# EAGLE design TapController_12V_v1.1 (EAGLE 9.4.0)

## Sheet 1 of 3
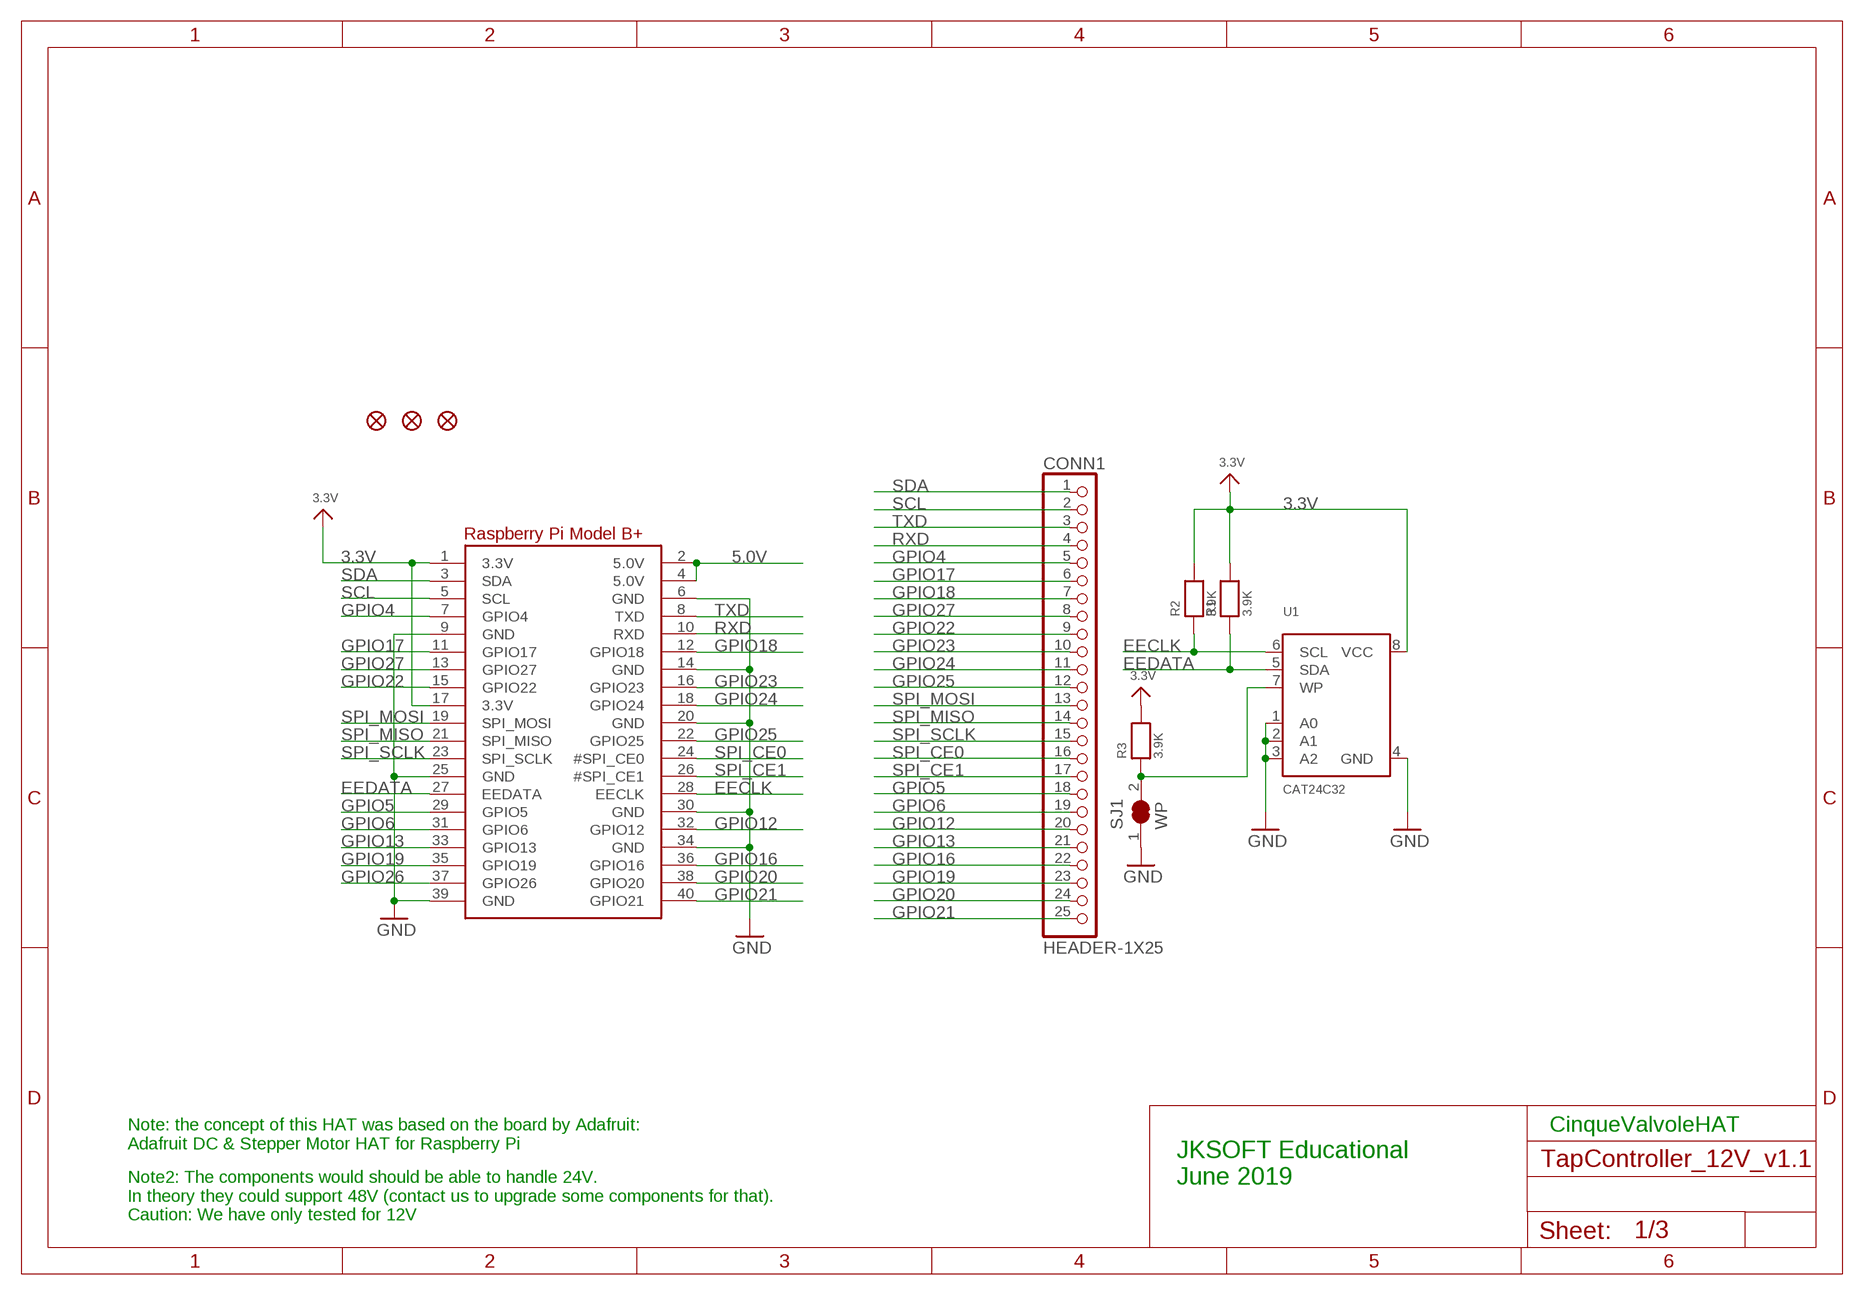
[diagram p0: schematic, sheet 1]

### Parts
CONN1  HEADER-1X25  [1X25_ROUND_70MIL]
FID1  FIDUCIAL""  [FIDUCIAL_1MM]
FID2  FIDUCIAL""  [FIDUCIAL_1MM]
FID3  FIDUCIAL""  [FIDUCIAL_1MM]
R1  3.9K  RESISTOR0805_NOOUTLINE  [0805-NO@1]
R2  3.9K  RESISTOR0805_NOOUTLINE  [0805-NO@1]
R3  3.9K  RESISTOR0805_NOOUTLINE  [0805-NO@1]
RPI1  RASPBERRYPI_BPLUS_HATSLOTS  [PI_HAT_SLOTS]
SJ1  WP  SOLDERJUMPER_CLOSED  [SOLDERJUMPER_CLOSEDWIRE]
U1  CAT24C32  EEPROM_I2C_SOIC8_GENERIC  [SOIC8_150MIL]

### Nets
3.3V: R1.2 R2.2 R3.2 RPI1.1(3.3V) RPI1.17(3.3V) U1.8(VCC) ; also sheet 2
5.0V: RPI1.2(5.0V) RPI1.4(5.0V)
EECLK: R2.1 RPI1.28(EECLK) U1.6(SCL)
EEDATA: R1.1 RPI1.27(EEDATA) U1.5(SDA)
GND: RPI1.6(GND) RPI1.9(GND) RPI1.14(GND) RPI1.20(GND) RPI1.25(GND) RPI1.30(GND) RPI1.34(GND) RPI1.39(GND) SJ1.1 U1.1(A0) U1.2(A1) U1.3(A2) U1.4(GND) ; also sheet 2,3
GPIO4: CONN1.5 RPI1.7(GPIO4)
GPIO5: CONN1.18 RPI1.29(GPIO5)
GPIO6: CONN1.19 RPI1.31(GPIO6)
GPIO12: CONN1.20 RPI1.32(GPIO12)
GPIO13: CONN1.21 RPI1.33(GPIO13)
GPIO16: CONN1.22 RPI1.36(GPIO16)
GPIO17: CONN1.6 RPI1.11(GPIO17)
GPIO18: CONN1.7 RPI1.12(GPIO18)
GPIO19: CONN1.23 RPI1.35(GPIO19)
GPIO20: CONN1.24 RPI1.38(GPIO20)
GPIO21: CONN1.25 RPI1.40(GPIO21)
GPIO22: CONN1.9 RPI1.15(GPIO22)
GPIO23: CONN1.10 RPI1.16(GPIO23)
GPIO24: CONN1.11 RPI1.18(GPIO24)
GPIO25: CONN1.12 RPI1.22(GPIO25)
GPIO26: RPI1.37(GPIO26)
GPIO27: CONN1.8 RPI1.13(GPIO27)
N$16: R3.1 SJ1.2 U1.7(WP)
RXD: CONN1.4 RPI1.10(RXD)
SCL: CONN1.2 RPI1.5(SCL) ; also sheet 2
SDA: CONN1.1 RPI1.3(SDA) ; also sheet 2
SPI_CE0: CONN1.16 RPI1.24(#SPI_CE0)
SPI_CE1: CONN1.17 RPI1.26(#SPI_CE1)
SPI_MISO: CONN1.14 RPI1.21(SPI_MISO)
SPI_MOSI: CONN1.13 RPI1.19(SPI_MOSI)
SPI_SCLK: CONN1.15 RPI1.23(SPI_SCLK)
TXD: CONN1.3 RPI1.8(TXD)

### Notes on the sheet
- CinqueValvoleHAT
- Note: the concept of this HAT was based on the board by Adafruit:
  Adafruit DC & Stepper Motor HAT for Raspberry Pi
- JKSOFT Educational
  June 2019
- Note2: The components would should be able to handle 24V. 
  In theory they could support 48V (contact us to upgrade some components for that).
  Caution: We have only tested for 12V

## Sheet 2 of 3
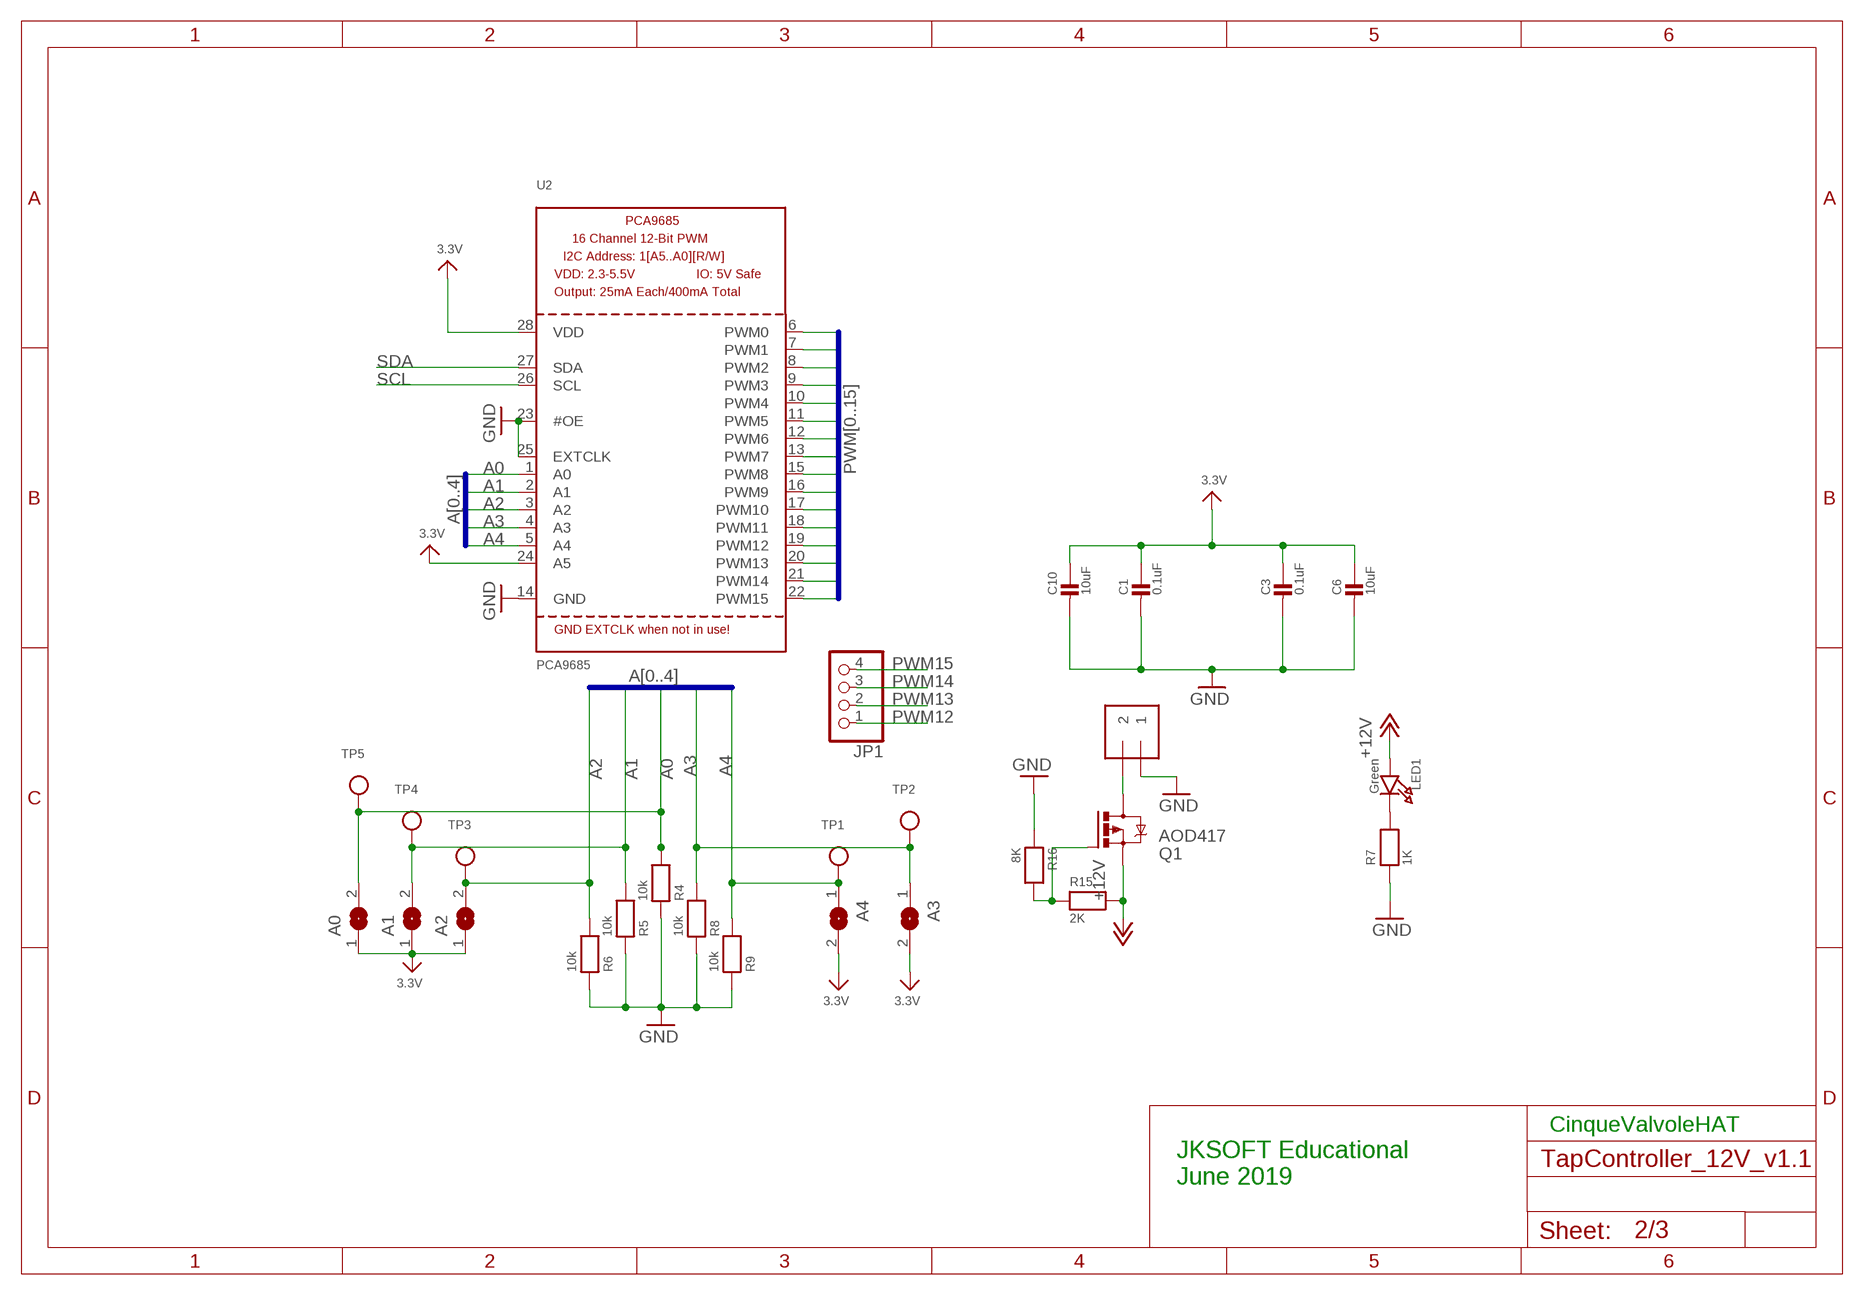
[diagram p1: schematic, sheet 2]

### Parts
A0  SOLDERJUMPERREFLOW_NOPASTE  [SOLDERJUMPER_REFLOW_NOPASTE]
A1  SOLDERJUMPERREFLOW_NOPASTE  [SOLDERJUMPER_REFLOW_NOPASTE]
A2  SOLDERJUMPERREFLOW_NOPASTE  [SOLDERJUMPER_REFLOW_NOPASTE]
A3  SOLDERJUMPERREFLOW_NOPASTE  [SOLDERJUMPER_REFLOW_NOPASTE]
A4  SOLDERJUMPERREFLOW_NOPASTE  [SOLDERJUMPER_REFLOW_NOPASTE]
C1  0.1uF  CAP_CERAMIC0805-NOOUTLINE  [0805-NO]
C3  0.1uF  CAP_CERAMIC0805-NOOUTLINE  [0805-NO]
C6  10uF  CAP_CERAMIC0805-NOOUTLINE  [0805-NO]
C10  10uF  CAP_CERAMIC0805-NOOUTLINE  [0805-NO]
JP1  HEADER-1X476MIL  [1X04_ROUND_76]
LED1  Green  LED0805_NOOUTLINE  [CHIPLED_0805_NOOUTLINE]
MPOWER  1X2-3.5MM  [1X2-3.5MM]
Q1  AOD417  IRFR5305  [D-PAK_TO252AA]
R4  10k  RESISTOR0805_NOOUTLINE  [0805-NO@1]
R5  10k  RESISTOR0805_NOOUTLINE  [0805-NO@1]
R6  10k  RESISTOR0805_NOOUTLINE  [0805-NO@1]
R7  1K  RESISTOR0805_NOOUTLINE  [0805-NO@1]
R8  10k  RESISTOR0805_NOOUTLINE  [0805-NO@1]
R9  10k  RESISTOR0805_NOOUTLINE  [0805-NO@1]
R15  2K  RESISTOR0805_NOOUTLINE  [0805-NO@1]
R16  8K  RESISTOR0805_NOOUTLINE  [0805-NO@1]
TP1  TESTPOINTROUND2MM  [TESTPOINT_ROUND_2MM]
TP2  TESTPOINTROUND2MM  [TESTPOINT_ROUND_2MM]
TP3  TESTPOINTROUND2MM  [TESTPOINT_ROUND_2MM]
TP4  TESTPOINTROUND2MM  [TESTPOINT_ROUND_2MM]
TP5  TESTPOINTROUND2MM  [TESTPOINT_ROUND_2MM]
U2  PCA9685  [TSSOP28]

### Nets
3.3V: A0.1 A1.1 A2.1 A3.2 A4.2 C1.1 C3.1 C6.1 C10.1 U2.24(A5) U2.28(VDD) ; also sheet 1
12V: MPOWER.2 Q1.4(D)
+12V: LED1.A Q1.3(S) R15.2 ; also sheet 3
A0: A0.2 R4.2 TP5.P$1 U2.1(A0)
A1: A1.2 R5.2 TP4.P$1 U2.2(A1)
A2: A2.2 R6.2 TP3.P$1 U2.3(A2)
A3: A3.1 R8.2 TP2.P$1 U2.4(A3)
A4: A4.1 R9.2 TP1.P$1 U2.5(A4)
GND: C1.2 C3.2 C6.2 C10.2 MPOWER.1 R4.1 R5.1 R6.1 R7.1 R8.1 R9.1 R16.1 U2.14(GND) U2.23(#OE) U2.25(EXTCLK) ; also sheet 1,3
N$3: Q1.1(G) R15.1 R16.2
N$133: LED1.C R7.2
PWM0: U2.6(PWM0) ; also sheet 3
PWM1: U2.7(PWM1) ; also sheet 3
PWM2: U2.8(PWM2) ; also sheet 3
PWM3: U2.9(PWM3) ; also sheet 3
PWM4: U2.10(PWM4) ; also sheet 3
PWM5: U2.11(PWM5) ; also sheet 3
PWM6: U2.12(PWM6) ; also sheet 3
PWM7: U2.13(PWM7) ; also sheet 3
PWM8: U2.15(PWM8) ; also sheet 3
PWM9: U2.16(PWM9) ; also sheet 3
PWM10: U2.17(PWM10)
PWM11: U2.18(PWM11)
PWM12: JP1.1 U2.19(PWM12)
PWM13: JP1.2 U2.20(PWM13)
PWM14: JP1.3 U2.21(PWM14)
PWM15: JP1.4 U2.22(PWM15)
SCL: U2.26(SCL) ; also sheet 1
SDA: U2.27(SDA) ; also sheet 1

### Buses
PWM[0..15]
A[0..4]

### Notes on the sheet
- CinqueValvoleHAT
- JKSOFT Educational
  June 2019

## Sheet 3 of 3
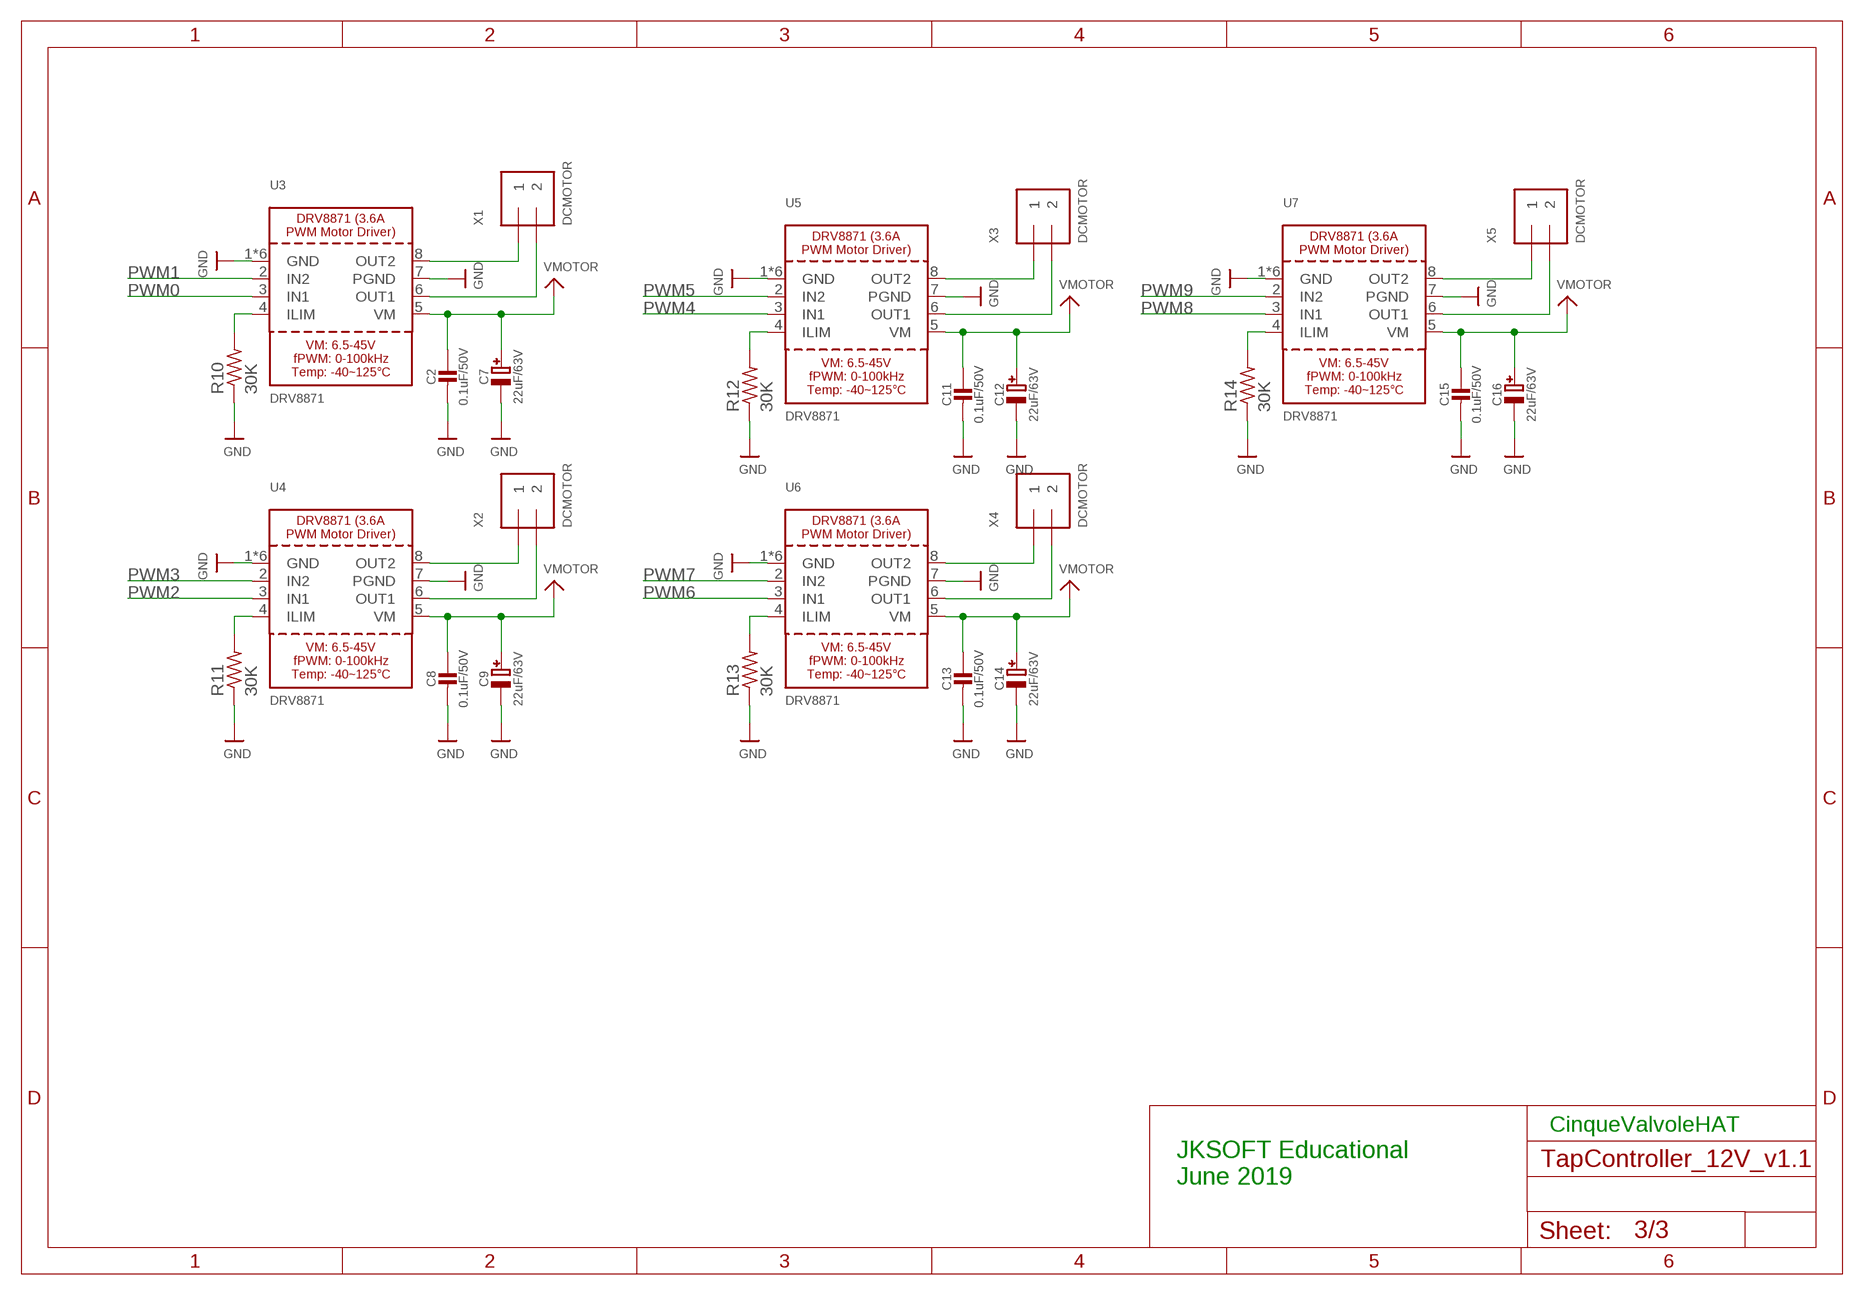
[diagram p2: schematic, sheet 3]

### Parts
C2  0.1uF/50V  CAP_CERAMIC0805-NOOUTLINE  [0805-NO]
C7  22uF/63V  CAP_ELECTROLYTICPANASONIC_D  [PANASONIC_D]
C8  0.1uF/50V  CAP_CERAMIC0805-NOOUTLINE  [0805-NO]
C9  22uF/63V  CAP_ELECTROLYTICPANASONIC_D  [PANASONIC_D]
C11  0.1uF/50V  CAP_CERAMIC0805-NOOUTLINE  [0805-NO]
C12  22uF/63V  CAP_ELECTROLYTICPANASONIC_D  [PANASONIC_D]
C13  0.1uF/50V  CAP_CERAMIC0805-NOOUTLINE  [0805-NO]
C14  22uF/63V  CAP_ELECTROLYTICPANASONIC_D  [PANASONIC_D]
C15  0.1uF/50V  CAP_CERAMIC0805-NOOUTLINE  [0805-NO]
C16  22uF/63V  CAP_ELECTROLYTICPANASONIC_D  [PANASONIC_D]
R10  30K  R-US_R0805W  [R0805W]
R11  30K  R-US_R0805W  [R0805W]
R12  30K  R-US_R0805W  [R0805W]
R13  30K  R-US_R0805W  [R0805W]
R14  30K  R-US_R0805W  [R0805W]
U3  DRV8871  [HSOP8]
U4  DRV8871  [HSOP8]
U5  DRV8871  [HSOP8]
U6  DRV8871  [HSOP8]
U7  DRV8871  [HSOP8]
X1  DCMOTOR  TERMBLOCK_1X2  [TERMBLOCK_1X2-3.5MM]
X2  DCMOTOR  TERMBLOCK_1X2  [TERMBLOCK_1X2-3.5MM]
X3  DCMOTOR  TERMBLOCK_1X2  [TERMBLOCK_1X2-3.5MM]
X4  DCMOTOR  TERMBLOCK_1X2  [TERMBLOCK_1X2-3.5MM]
X5  DCMOTOR  TERMBLOCK_1X2  [TERMBLOCK_1X2-3.5MM]

### Nets
+12V: C2.1 C7.+ C8.1 C9.+ C11.1 C12.+ C13.1 C14.+ C15.1 C16.+ U3.5(VM) U4.5(VM) U5.5(VM) U6.5(VM) U7.5(VM) ; supply symbol labelled VMOTOR ; also sheet 2
GND: C2.2 C7.- C8.2 C9.- C11.2 C12.- C13.2 C14.- C15.2 C16.- R10.1 R11.1 R12.1 R13.1 R14.1 U3.1(GND) U3.7(PGND) U3.GND U3.P$1(GND) U3.P$2(GND) U3.P$3(GND) U3.P$4(GND) U4.1(GND) U4.7(PGND) U4.GND U4.P$1(GND) U4.P$2(GND) U4.P$3(GND) U4.P$4(GND) U5.1(GND) U5.7(PGND) U5.GND U5.P$1(GND) U5.P$2(GND) U5.P$3(GND) U5.P$4(GND) U6.1(GND) U6.7(PGND) U6.GND U6.P$1(GND) U6.P$2(GND) U6.P$3(GND) U6.P$4(GND) U7.1(GND) U7.7(PGND) U7.GND U7.P$1(GND) U7.P$2(GND) U7.P$3(GND) U7.P$4(GND) ; also sheet 1,2
N$1: R10.2 U3.4(ILIM)
N$88: R11.2 U4.4(ILIM)
N$89: R12.2 U5.4(ILIM)
N$90: R13.2 U6.4(ILIM)
N$91: R14.2 U7.4(ILIM)
OUT1: U3.6(OUT1) X1.2
OUT2: U3.8(OUT2) X1.1
OUT3: U4.8(OUT2) X2.1
OUT4: U4.6(OUT1) X2.2
OUT5: U5.8(OUT2) X3.1
OUT6: U5.6(OUT1) X3.2
OUT7: U6.8(OUT2) X4.1
OUT8: U6.6(OUT1) X4.2
OUT9: U7.8(OUT2) X5.1
OUT10: U7.6(OUT1) X5.2
PWM0: U3.3(IN1) ; also sheet 2
PWM1: U3.2(IN2) ; also sheet 2
PWM2: U4.3(IN1) ; also sheet 2
PWM3: U4.2(IN2) ; also sheet 2
PWM4: U5.3(IN1) ; also sheet 2
PWM5: U5.2(IN2) ; also sheet 2
PWM6: U6.3(IN1) ; also sheet 2
PWM7: U6.2(IN2) ; also sheet 2
PWM8: U7.3(IN1) ; also sheet 2
PWM9: U7.2(IN2) ; also sheet 2

### Notes on the sheet
- CinqueValvoleHAT
- JKSOFT Educational
  June 2019

## Library data of the parts
A0 A1-A4 = microbuilder:SOLDERJUMPER: SMD Solder JUMPER Solder the two pads together to create a connection, or remove the solder to break it. REFLOW - Use this footprint for solder paste and reflow ovens. WAVE - Use this footprint for hand-soldering (larger pads). CLOSED - Has a trace between the two pads to ensure it is closed by default. The trace needs to be cut to disable the jumper, and can be closed again by creating a solder bridge between the two pads.
C1-C3 C6 C8 C10 C11 C13 C15 = microbuilder:CAP_CERAMIC: Ceramic Capacitors For new designs, use the packages preceded by an '_' character since they are more reliable: The following footprints should be used on most boards: _0402 - Standard footprint for regular board layouts _0603 - Standard footprint for regular board layouts _0805 - Standard footprint for regular board layouts _1206 - Standard footprint for regular board layouts For extremely tight-pitch boards where space is at a premium, the following 'micro-pitch' footprints can be used (smaller pads, no silkscreen outline, etc.): _0402MP - Micro-pitch footprint for very dense/compact boards _0603MP - Micro-pitch footprint for very dense/compact boards _0805MP - Micro-pitch footprint for very dense/compact boards _1206MP - Micro-pitch footprint for very dense/compact boards
C7 C9 C12 C14 C16 = microbuilder:CAP_ELECTROLYTIC: Electrolytic Capacitors SMT PANASONIC_C - Size C Panasonic Electrolytic Aluminum Capacitor 47µF 16V 20% Electrolytic Capacitor [Digikey: PCE3890TR-ND] PANASONIC_D - Size D Panasonic Electrolytic Aluminum Capacitor 100µF 25V 20% Electrolytic Capacitor [Digikey: PCE3898TR-ND] PTH 3.5 mm grid, 8 mm diameter ... 3.5 mm grid, 10 mm diameter ...
CONN1 = microbuilder:HEADER-1X25
FID1-FID3 = microbuilder:FIDUCIAL: Fiducial Alignment Points Various fiducial points for machine vision alignment.; BOM: EXCLUDE
JP1 = microbuilder:HEADER-1X4: PIN HEADER
LED1 = microbuilder:LED: LED 0603 - 0603 Surface Mount Package 2mA: Green LED - Low Power (3.9mcd, 2ma, 1.7Vf) - Digikey: 475-2709-2-ND Orange LED - Low Power (9.8mcd, 2ma, 1.8Vf) - Digikey: 475-1194-2-ND Red LED - Low Power (5mcd, 2ma, 1.8Vf) - Digikey: 475-1195-2-ND Yellow LED - Low Power (7mcd, 2ma, 1.8Vf) - Digikey: 475-1196-2-ND 5mA: Blue LED - Low Power (17mcd, 5ma, 2.9Vf) - Digikey: LNJ937W8CRACT-ND 0805 - 0805 Surface Mount Package 2mA: Red LED (8.8mcd, 2mA, 1.8Vf, Clear) - Low Power [Digikey: 475-2510-1-ND] Green LED (5mcd, 2mA, 1.8Vf, Clear) - Low Power [Digikey: 475-2730-1-ND] Yellow LED (11.3mcd, 2mA, 1.8Vf, Clear) - Low Power [Digikey: 475-2555-1-ND] 20mA: Red LED (104mcd, 20mA, Diffused) - LS R976 [Digikey: 475-1278-6-ND] Red LED (12mcd, 20mA, 2.0Vf, Clear) - APT2012EC [Digikey: 754-1128-1-ND] Green LED (15mcd, 20mA, 2.2Vf, Clear) - APT2012GC [Digikey: 754-1131-1-ND] Orange LED (160mcd, 20mA, 2.1Vf, Clear) - APT2012SECK [Digikey: 754-1130-1-ND] 1206 - 1206 Surface Mount Package Green LED (26mcd, 20mA, Diffused) - LG N971 [Digikey: 475-1407-6-ND] Red LED (15mcd, 20mA, Diffused) - LH N974 [Digikey: 475-1416-6-ND] Cree - Cree High-Power Surface Mount LEDs XPEBWT-L1-0000-00D50 - White 111lm 350mA 2.9Vf 6200K 110° XTEAWT-00-0000-00000LEE3 - White 114lm 350mA 2.85Vf 5000K 115° Everlight - Everlight 45-21 Series Surface Mount LEDs 45-21/QK2C-B2832AC2CB2/2T - Warm White 2000mcd 20mA 3.25Vf 3050K 120° 45-21/LK2C-B38452C4CB2/2T - Nuetral White 2000mcd 20mA 3.25Vf 4150K 120° 45-21/LK2C-B50634C6CB2/2T - Cold White 2200mcd 20mA 3.25Vf 5650K 120° PLCC2 Reverse Mount LS T77K-J1L2-1-0-2-R18-Z - Red 11.25mcd 2mA 1.8Vf 630nm 120° LO T77K-L1M2-24-Z - Orange 19.6mcd 2mA 1.8Vf 606nm 120° LY T77K-K2M1-26-Z - Yellow 15.7mcd 2mA 1.8Vf 587nm 120°
MPOWER = adafruit:1X2: 3.5mm Terminal block http://www.ladyada.net/library/pcb/eaglelibrary.html
Q1 = transistor-power:IRF?5305: HEXFET Power MOSFET Source: http://www.irf.com/product-info/datasheets/data/irfr5305pbf.pdf
R1-R9 R15 R16 = microbuilder:RESISTOR: Resistors For new designs, use the packages preceded by an '_' character since they are more reliable: The following footprints should be used on most boards: _0402 - Standard footprint for regular board layouts _0603 - Standard footprint for regular board layouts _0805 - Standard footprint for regular board layouts For extremely tight-pitch boards where space is at a premium, the following 'micro-pitch' footprints can be used (smaller pads, no silkscreen outline, etc.): _0402MP - Micro-pitch footprint for very dense/compact boards _0603MP - Micro-pitch footprint for very dense/compact boards _0805MP - Micro-pitch footprint for very dense/compact boards
R10-R14 = adafruit:R-US_: RESISTOR, American symbol
RPI1 = microbuilder:RASPBERRYPI_BPLUS
SJ1 = microbuilder:SOLDERJUMPER_CLOSED: Solder Jumper - Closed These solder jumpers are closed by default CLOSEDWIRE - 10 mil trace between pads that can be cut and resoldered later CLOSEDPERM - 63 mil trace between pads for a permanent connection (used to 'bridge' two signals, a shameless hack for Eagle). Can double as a test point as well (no cream layer)
TP1-TP5 = microbuilder:TESTPOINT: Test Point Various test points for characterisation and PCB testing TESTPOINT_SMT - Compact Surface Mount Test Point [Digikey: 5016KTR-ND]
U1 = microbuilder:EEPROM_I2C_SOIC8_GENERIC: Note: The same pinout is used for many I2C EEPROMs in SOIC8(150mil) from a variety of manufacturers and in various sizes. Examples: 16K (2K x 8 Bit) I2C EEPROM 1.7-5.5V, 400KHz, -40°C-85°C Digikey: CAT24C16WI-GT3CT-ND 256K (32K x 8 Bit) I2C EEPROM 1.7-5.5V, 400KHz, -40°C-85°C Digikey: 24AA256-I/SN-ND
U2 = microbuilder:PCA9685: PCA9685 - 16 Channel 12-Bit I2C PWM Controller 5.0V tolerant 16 channel, 12-bit I2C PWM controller with 25mA per output (max. 400mA total) Digikey: 568-5931-1-ND
U3-U7 = microbuilder:DRV8871: DRV8871 - 3.6A PWM Motor Driver
X1-X5 = microbuilder:TERMBLOCK_1X2: 3.5mm Terminal block http://www.ladyada.net/library/pcb/eaglelibrary.html

## Board
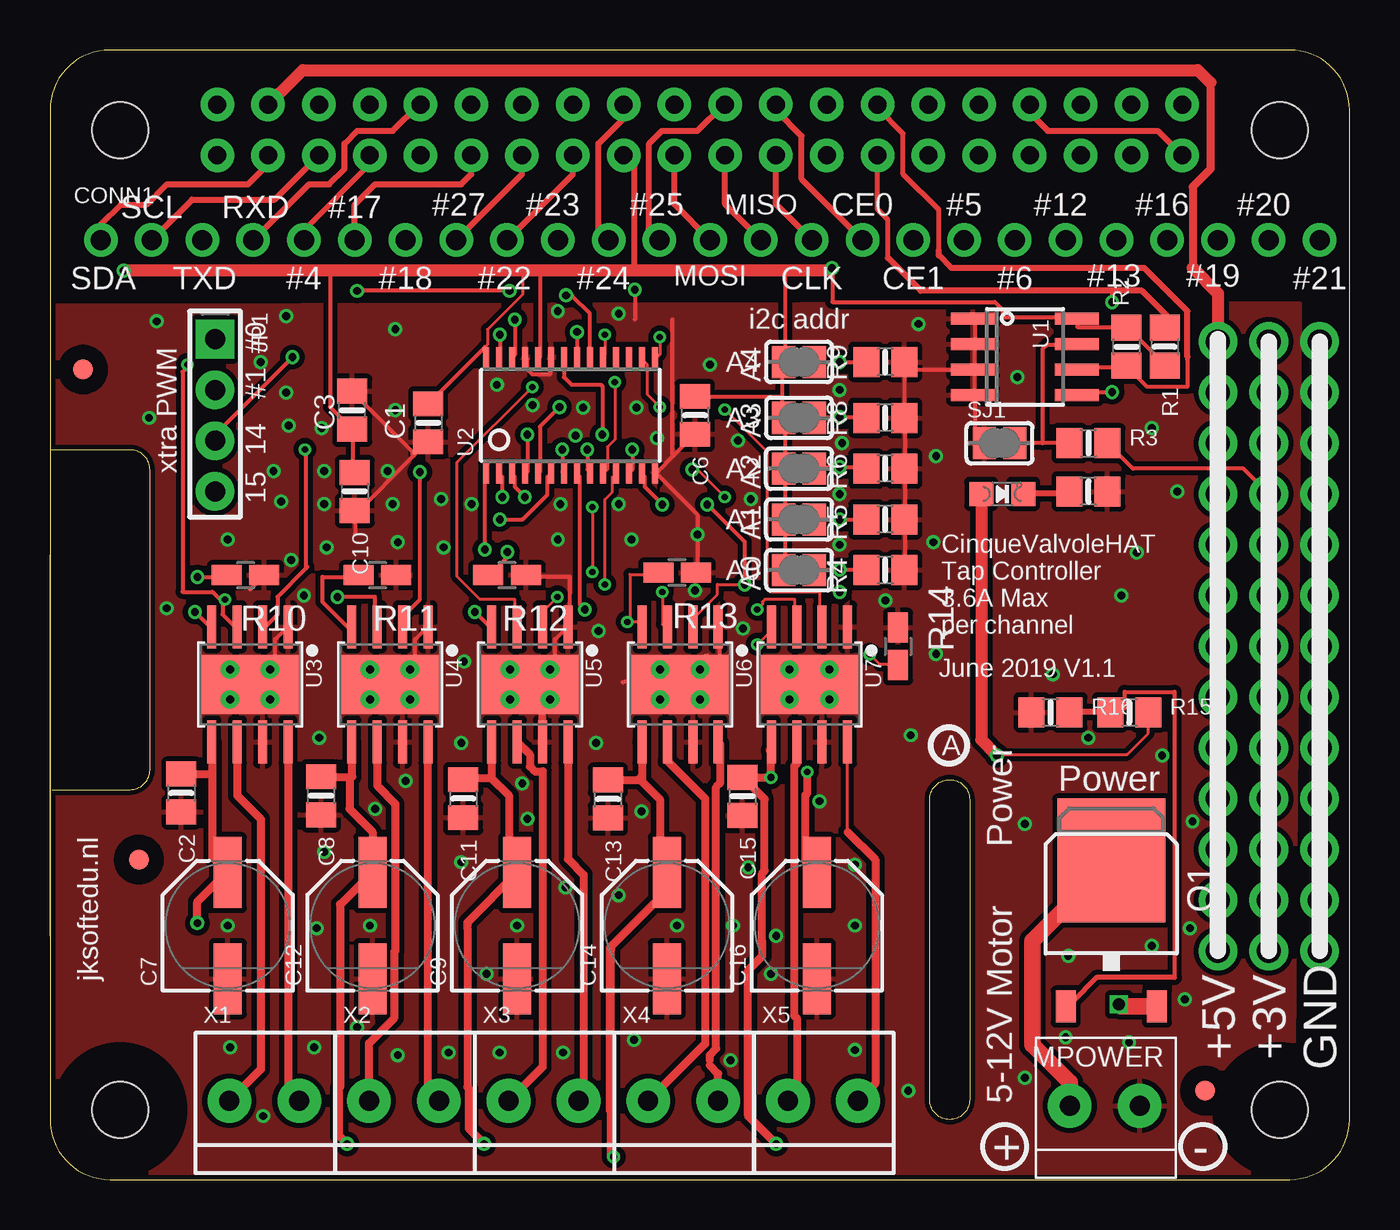
[diagram p3: board, top side]
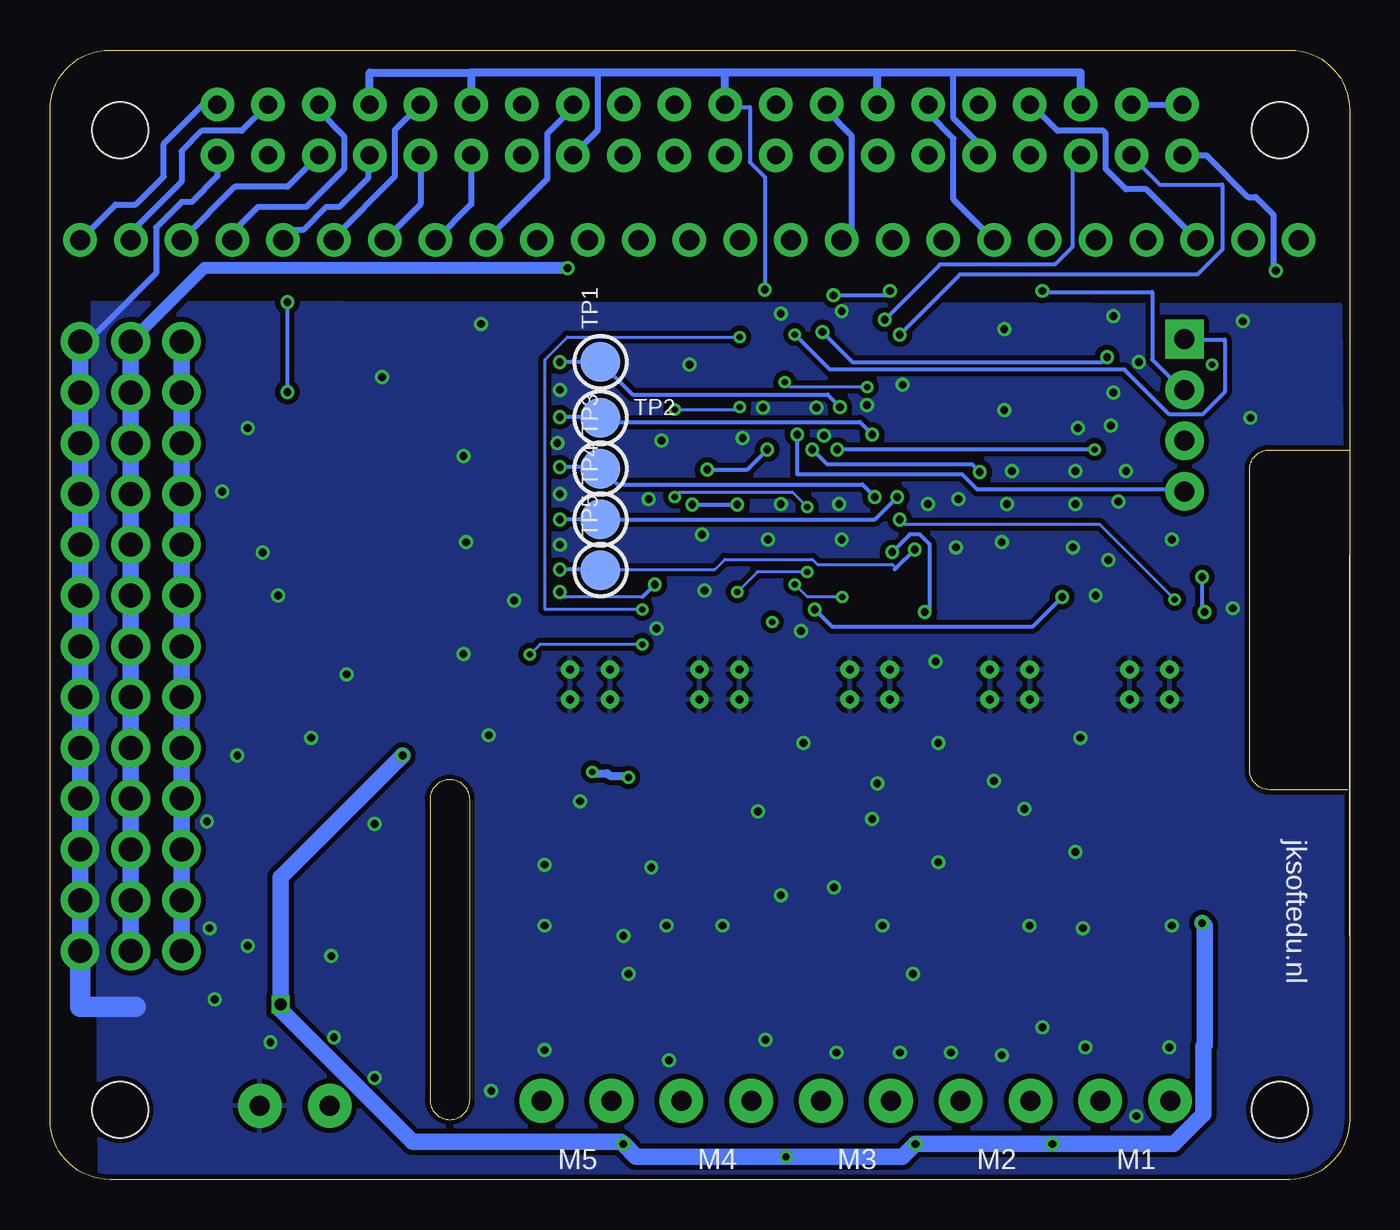
[diagram p4: board, bottom side, seen from below]

Size 65 x 56.5 mm. Coordinates in mm from the lower left corner, seen from the top.
Outline: 0,19.56 0,19.68
Outline: 0,12.19 0,31.24
Copper layers (1*16): Top 0.035mm / dielectric 1.5mm / Bottom 0.035mm
Design rules "SeeedStudio_2layer_DRU_no_angle_20140221": minimum track width 6mil, minimum drill 12mil, track to track 6mil, track to pad 6mil, pad to pad 6mil, via to via 6mil, smd to smd 0mil, copper to edge 10mil, drill to drill 10mil, minimum pad ring 10mil, minimum via ring 6mil, stop-mask expansion 2mil, vias tented up to drill 100mil, thermal gap 10mil

### Footprints (pad centres in the part's own frame; a part is rotated, then mirrored left to right if it is on the bottom)
SOLDERJUMPER_REFLOW_NOPASTE = smd 1.168 x 1.6: 1 -0.762,0; 2 0.762,0
0805-NO = smd 1.24 x 1.5: 1 -0.95,0; 2 0.95,0
PANASONIC_D = smd 3.556 x 1.4: + 2.654,0; - -2.654,0
1X25_ROUND_70MIL = drill 1 pad 1.676: 1 -30.48,0; 2 -27.94,0; 3 -25.4,0; 4 -22.86,0; 5 -20.32,0; 6 -17.78,0; 7 -15.24,0; 8 -12.7,0; 9 -10.16,0; 10 -7.62,0; 11 -5.08,0; 12 -2.54,0; 13 0,0; 14 2.54,0; 15 5.08,0; 16 7.62,0; 17 10.16,0; 18 12.7,0; 19 15.24,0; 20 17.78,0; 21 20.32,0; 22 22.86,0; 23 25.4,0; 24 27.94,0; 25 30.48,0
FIDUCIAL_1MM = smd 1 x 1: 1 0,0
1X04_ROUND_76 = drill 1 pad 1.93 square: 1 -3.81,0 | drill 1 pad 1.93: 2 -1.27,0; 3 1.27,0; 4 3.81,0
CHIPLED_0805_NOOUTLINE = smd 1.2 x 1.2: A 0,-1.05; C 0,1.05
1X2-3.5MM = drill 1 pad 2.184: 1 1.8,0; 2 -1.7,0
D-PAK_TO252AA = smd 1 x 1.6: 1 -2.28,-4.8; 3 2.28,-4.8 | smd 5.4 x 6.2: 4 0,2.5
0805-NO@1 = smd 1.3 x 1.5: 1 -0.95,0; 2 0.95,0
R0805W = smd 1.5 x 1: 1 -0.94,0; 2 0.94,0
PI_HAT_SLOTS = drill 0.9 pad 1.676: 1 8.37,51.23; 2 8.37,53.77; 3 10.91,51.23; 4 10.91,53.77; 5 13.45,51.23; 6 13.45,53.77; 7 15.99,51.23; 8 15.99,53.77; 9 18.53,51.23; 10 18.53,53.77; 11 21.07,51.23; 12 21.07,53.77; 13 23.61,51.23; 14 23.61,53.77; 15 26.15,51.23; 16 26.15,53.77; 17 28.69,51.23; 18 28.69,53.77; 19 31.23,51.23; 20 31.23,53.77; 21 33.77,51.23; 22 33.77,53.77; 23 36.31,51.23; 24 36.31,53.77; 25 38.85,51.23; 26 38.85,53.77; 27 41.39,51.23; 28 41.39,53.77; 29 43.93,51.23; 30 43.93,53.77; 31 46.47,51.23; 32 46.47,53.77; 33 49.01,51.23; 34 49.01,53.77; 35 51.55,51.23; 36 51.55,53.77; 37 54.09,51.23; 38 54.09,53.77; 39 56.63,51.23; 40 56.63,53.77 | hole 2.8: 3.5,3.5; 3.5,52.5; 61.5,52.5; 61.5,3.5
SOLDERJUMPER_CLOSEDWIRE = smd 1.168 x 1.6: 1 -0.762,0; 2 0.762,0 | smd 0.635 x 0.203: WIRE 0,0
TESTPOINT_ROUND_2MM = smd 2 x 2: P$1 0,0
SOIC8_150MIL = smd 0.6 x 2.2: 1 -1.905,-2.6; 2 -0.635,-2.6; 3 0.635,-2.6; 4 1.905,-2.6; 5 1.905,2.6; 6 0.635,2.6; 7 -0.635,2.6; 8 -1.905,2.6
TSSOP28 = smd 0.305 x 0.991: 1 -4.225,-2.918; 2 -3.575,-2.918; 3 -2.925,-2.918; 4 -2.275,-2.918; 5 -1.625,-2.918; 6 -0.975,-2.918; 7 -0.325,-2.918; 8 0.325,-2.918; 9 0.975,-2.918; 10 1.625,-2.918; 11 2.275,-2.918; 12 2.925,-2.918; 13 3.575,-2.918; 14 4.225,-2.918; 15 4.225,2.918; 16 3.575,2.918; 17 2.925,2.918; 18 2.275,2.918; 19 1.625,2.918; 20 0.975,2.918; 21 0.325,2.918; 22 -0.325,2.918; 23 -0.975,2.918; 24 -1.625,2.918; 25 -2.275,2.918; 26 -2.925,2.918; 27 -3.575,2.918; 28 -4.225,2.918
HSOP8 = smd 0.45 x 2.15: 1 -1.905,-2.875; 2 -0.635,-2.875; 3 0.635,-2.875; 4 1.905,-2.875; 5 1.905,2.875; 6 0.635,2.875; 7 -0.635,2.875; 8 -1.905,2.875 | smd 4.9 x 2.95: GND 0,0 | drill 0.4: P$1 -1,0.75; P$2 -1,-0.75; P$3 1,-0.75; P$4 1,0.75
TERMBLOCK_1X2-3.5MM = drill 1 pad 2.184: 1 1.8,0; 2 -1.7,0

### Placement (x,y rotation side)
A0  37.47,30.48 0 top
A1  37.47,33.02 0 top
A2  37.47,35.56 0 top
A3  37.47,38.1 180 top
A4  37.47,40.89 180 top
C1  18.92,37.85 270 top
C2  6.57,19.34 270 top
C3  15.11,38.48 90 top
C6  32.26,38.23 270 top
C7  8.89,12.7 90 top
C8  13.55,19.2 270 top
C9  23.37,12.7 90 top
C10  15.24,34.42 270 top
C11  20.67,19.05 270 top
C12  16.13,12.7 90 top
C13  27.91,19.03 270 top
C14  30.86,12.7 90 top
C15  34.64,19.16 270 top
C16  38.35,12.7 90 top
CONN1  33.02,46.99 0 top
FID1  1.65,40.51 0 top
FID2  57.78,4.45 0 top
FID3  4.45,16 0 top
JP1  8.26,38.23 270 top
LED1  47.62,34.29 270 top
MPOWER  52.7,3.68 0 top
Q1  53.09,13.46 0 top
R1  55.75,41.66 270 top
R2  53.85,41.66 90 top
R3  51.94,36.83 0 top
R4  41.78,30.48 180 top
R5  41.78,33.02 180 top
R6  41.78,35.56 180 top
R7  51.94,34.42 180 top
R8  41.78,38.1 180 top
R9  41.78,40.89 180 top
R10  9.78,30.23 180 top
R11  16.38,30.23 180 top
R12  22.86,30.23 180 top
R13  31.37,30.35 180 top
R14  42.42,26.67 270 top
R15  53.98,23.37 0 top
R16  50.04,23.37 0 top
RPI1  0,0 0 top
SJ1  47.5,36.83 0 top
TP1  37.47,40.89 90 bottom
TP2  37.47,38.1 0 bottom
TP3  37.47,35.56 90 bottom
TP4  37.47,33.02 90 bottom
TP5  37.47,30.48 90 bottom
U1  48.77,41.15 270 top
U2  26.04,38.23 0 top
U3  10,24.77 180 top
U4  17,24.77 180 top
U5  24,24.77 180 top
U6  31.52,24.77 180 top
U7  37.98,24.77 180 top
U$6  [PCBFEAT-REV-040]  44.96,21.72 0 top
X1  10.67,3.94 0 top
X2  17.65,3.94 0 top
X3  24.64,3.94 0 top
X4  31.62,3.94 0 top
X5  38.61,3.94 0 top

### Tracks (layer width: path | path; a pad name or v marks a point on that pad's centre or on a via)
3.3V  (via drill 0.39, 1.2 pad 1.93)
  Top 0.152: 21.75,41.65 21.88,41.77 21.88,42.52 23.62,44.27 23.62,45.47
  Top 0.203: 36.75,33.02 36.75,30.52 A0.1 | 36.62,39.15 32.38,39.15 C6.1 | 36.62,39.15 36.62,38.15 A3.2 36.75,38.02 36.75,35.65 A2.1 36.75,35.52 36.75,33.02 | 36.62,39.15 36.62,40.77 A4.2 36.75,40.9 36.75,45.47 | 36.75,33.02 A1.1 | R3.2 54.16,35.56 59.69,35.56 v60.96,34.29 | R1.2 55.75,40.77 53.88,42.65 R2.2 53.75,42.65 51.38,42.65 51.38,43.02 U1.8 51.25,43.15 47.62,43.15 47.62,43.52 47.25,43.9 39.12,43.9 39.12,45.27 v39.12,45.59 | C10.1 15.12,35.4 15.12,37.52 C3.1 15,37.65 14,38.65 14,45.47 | U2.28 21.75,41.15 21.75,41.65 19,38.9 C1.1 | 24.5,45.47 24.5,41.15 U2.24
  Top 0.254: 29.21,45.59 29.21,45.47
  Top 0.305: RPI1.17 29.21,50.71 29.21,45.59
  Top 0.61: v3.68,45.47 14,45.47 23.62,45.47 24.5,45.47 29.21,45.47 36.75,45.47 38.99,45.47 v39.12,45.59
  Bottom 0.305: RPI1.1 7.16,51.23 5.08,49.15 4.7,49.15 3.81,48.26 3.81,45.47 v3.68,45.47 3.56,45.47
  Bottom 0.61: v39.12,45.59 57.28,45.59 v60.96,41.91
  Bottom 0.813: v60.96,11.43 v60.96,13.97 v60.96,16.51 v60.96,19.05 v60.96,21.59 v60.96,24.13 v60.96,26.67 v60.96,29.21 v60.96,31.75 v60.96,34.29 v60.96,36.83 v60.96,39.37 v60.96,41.91
5.0V  (via drill 1.2 pad 1.93)
  Top 0.406: 58.04,54.86 58.04,50.55 57.15,49.66 57.15,45.59
  Top 0.61: RPI1.4 12.64,55.5 57.4,55.5 58.04,54.86 | 57.15,45.59 58.42,44.32 v58.42,41.91
  Bottom 0.305: RPI1.4 RPI1.2
  Bottom 0.813: v58.42,41.91 v58.42,39.37 v58.42,36.83 v58.42,34.29 v58.42,31.75 v58.42,29.21 v58.42,26.67 v58.42,24.13 v58.42,21.59 v58.42,19.05 v58.42,16.51 v58.42,13.97 v58.42,11.43
12V
  Top 0.61: 52.58,15.37 52.58,15.45 Q1.4
  Top 0.813: MPOWER.2 51.01,4.88 49.15,6.73 49.15,11.94 52.58,15.37
+12V  (via drill 0.3, 0.35, 0.39, 0.6)
  Top 0.152: R15.2 54.92,22.31 53.88,21.27 47.62,21.27 v47.37,21.21 | 28.12,20.39 C13.1 | 29.5,21.77 U6.5 | 30.5,16.89 30.5,15.77 C14.+ | 36,21.39 36,21.46 36,21.89 U7.5 | 34.75,20.14 C15.1 34.75,20.02 34.94,19.83 | 28,11.27 27.88,11.14 27.88,3.4
  Top 0.203: 8.49,15.01 8.75,15.27 C7.+ | 20.88,12.7 20.88,12.57
  Top 0.406: C7.+ 8.13,16.12 8.13,20.32 | U3.5 8.13,21.86 8.13,20.32 | C2.1 8.1,20.29 8.13,20.32 | C8.1 14.99,20.14 | 14.99,20.14 15.11,20.14 15.11,21.88 U4.5 | 14.99,20.14 14.99,18.54 16.13,17.4 C12.+ 14.54,13.77 14.5,13.77 14.5,4.6 14.45,4.56 14.45,2.18 v14.86,1.78 | 22.1,20.07 22.99,19.18 22.99,15.73 C9.+ 20.88,12.86 20.88,12.7 | 22.1,20.07 20.73,20.07 C11.1 | U5.5 22.1,20.07 | 29.59,21.88 U6.5 29.61,20.19 | 28.12,20.19 C13.1 29.4,19.98 29.61,20.19 | 20.88,12.57 20.88,4.63 20.95,4.56 20.95,2.54 v21.72,1.78 | v7.37,12.83 7.37,13.89 8.49,15.01 | 29.61,20.19 29.61,19.91 30.5,19.02 30.5,16.89 | v28.19,1.14 28.07,1.14 28.07,11.54 | 28.07,11.54 28.07,11.67 | 28.07,11.67 28,11.6 | 28,11.27 28,11.6 | 30.68,14.28 28.07,11.67 | 28,11.6 28.07,11.54 | 34.94,19.83 35.74,19.03 35.74,15.44 35.62,15.32 35.62,11.9 35.62,11.89 35.62,11.18 34.92,10.47 34.92,3.18 v36.32,1.78 | C15.1 v36.07,20.11 36.07,21.39 36,21.46 | v37.88,20.39 37.88,19.31 37.78,19.21 37.78,15.93 C16.+
  Top 0.61: 53.57,8.66 v53.47,8.76 | v47.37,21.21 46.58,22 LED1.A
  Top 0.813: Q1.3 53.57,8.66 | 30.73,15.48 C14.+ 30.86,14.46 30.68,14.28
  Bottom 0.406: v36.07,20.11 36.07,20.19 36.99,20.19 37.11,20.32 37.8,20.32 v37.88,20.39
  Bottom 0.813: v47.37,21.21 53.47,15.11 v53.47,8.76 53.47,8.49 46.87,1.9 36.44,1.9 v36.32,1.78 35.69,1.14 v28.19,1.14 22.35,1.14 v21.72,1.78 v14.86,1.78 8.79,1.78 7.32,3.25 7.32,6.65 7.24,6.73 7.24,12.69 v7.37,12.83
A0  (via drill 0.39)
  Top 0.203: R4.2 40.75,30.52 v39.5,30.52 38.25,30.52 A0.2 | v21.75,31.52 21.75,35.27 U2.1
  Bottom 0.152: 22.69,30.58 22.88,30.77 26.62,30.77 26.88,31.02 31.25,31.02 31.75,30.52 37.38,30.52
  Bottom 0.203: 22.75,30.52 22.69,30.58 v21.75,31.52 | 37.38,30.52 TP5.P$1 37.5,30.52 v39.5,30.52
A1  (via drill 0.39)
  Top 0.203: A1.2 v39.5,33.02 R5.2 | v22.62,34.15 22.62,35.15 22.5,35.27 U2.2
  Bottom 0.203: v22.62,34.15 23.75,33.02 TP4.P$1 v39.5,33.02
A2  (via drill 0.39)
  Top 0.203: R6.2 40.75,35.65 v39.5,35.65 38.25,35.65 A2.2 | v23.75,34.15 23.25,34.65 23.25,35.15 23.12,35.27 U2.3
  Bottom 0.203: v23.75,34.15 24.38,34.77 36.62,34.77 37.38,35.52 TP3.P$1 37.5,35.65 v39.5,35.65
A3  (via drill 0.39)
  Top 0.203: R8.2 40.75,38.15 v39.5,38.15 38.25,38.15 A3.1 | v23.88,37.27 23.88,35.4 U2.4
  Bottom 0.203: v23.88,37.27 24.5,37.89 37.23,37.89 TP2.P$1 37.5,38.15 v39.5,38.15
A4  (via drill 0.39)
  Top 0.203: R9.2 40.75,40.9 v39.5,40.9 38.25,40.9 A4.1 | v25.48,38.64 24.5,37.66 24.5,35.4 U2.5
  Bottom 0.203: v25.48,38.64 26.11,39.27 35.88,39.27 37.38,40.77 TP1.P$1 37.5,40.9 v39.5,40.9
EECLK
  Top 0.203: U1.6 51.38,40.65 53.75,40.65 R2.1 53.88,40.65 54.88,39.65 56.88,39.65 56.88,41.02 56.9,41.15
  Top 0.254: 44.45,46.48 44.45,48.51 42.67,50.29 42.67,52.32 41.39,53.61 RPI1.28
  Top 0.305: 56.9,41.15 56.9,43.43 54.74,45.59 45.09,45.59 44.45,46.23 44.45,46.48
EEDATA  (via drill 0.39)
  Top 0.203: R1.1 55.88,42.65 55.88,43.27 55.75,43.31 | v53.12,43.9 53.12,44.45 | v53.12,39.4 51.38,39.4 51.38,39.27 U1.5
  Top 0.254: 41.91,46.1 41.91,48.01 41.39,48.53 RPI1.27
  Top 0.305: 55.75,43.31 54.61,44.45 53.12,44.45 43.56,44.45 41.91,46.1
  Bottom 0.203: v53.12,39.4 v53.12,43.9
GND  (via drill 0.39, 1.2 pad 1.93)
  Top 0.152: 25,41.02 U2.23
  Top 0.203: U1.1 46.25,43.02 46.25,41.9 U1.2 46.25,41.77 46.25,40.52 U1.3 | SJ1.1 46.25,37.2 46.25,39.15 U1.4 46.25,39.27 46.25,40.4 U1.3 | 42.75,33.02 42.75,30.52 R4.1 | 42.75,40.52 42.75,38.15 R8.1 42.75,38.02 42.75,35.65 R6.1 42.75,35.52 42.75,33.02 | 42.75,40.52 42.75,40.77 R9.1 42.75,40.52 | 42.75,33.02 R5.1 | 42.75,40.52 46.12,40.52 U1.3 | U6.P$2 32.52,25.89 33.52,25.89 33.52,27.64 U6.1 | 15.25,33.27 15.25,33.4 C10.2 15.25,33.27 | 15.25,33.27 15.25,32.27 | 17.25,30.27 R11.1 17.25,30.14 17,29.89 | 15.25,33.27 18.19,36.21 | 18.19,36.21 18.88,36.9 C1.2 | C3.2 15.12,39.4 18.12,36.4 18.12,36.27 18.19,36.21 | U4.P$2 18.25,25.77 18.25,27.02 18.88,27.64 U4.1 | 10,29.52 10.62,30.14 R10.1 | U3.P$2 11.25,25.77 11.25,27.02 11.88,27.64 U3.1 | R12.1 23.88,30.14 26,30.14 26,27.64 U5.1 25.88,27.64 25.25,27.02 25.25,25.77 U5.P$2 | 28.65,24.88 32.88,26.23 | U7.1 | 25,41.02 25,40.27 24.12,40.27 23.88,40.52 23.88,41.02 U2.25 | 31.19,36.21 C6.2 | 31.19,36.21 30.38,35.4 U2.14 30.38,35.27 32.38,33.27 32.38,30.52 | 31.12,43.02 31.12,36.27 31.19,36.21 | 25.12,41.15 U2.23 | v29.25,44.52 29.25,43.02
  Top 0.305: RPI1.34 49.01,53.35 49.91,52.45 55.41,52.45 RPI1.39
  Top 0.406: U5.7 24.64,23.66 U5.P$1
  Bottom 0.203: v29.25,44.52 29.25,50.15 30,50.9 30,53.65 31.12,53.65 RPI1.20
  Bottom 0.305: RPI1.9 18.53,51.8 19.81,53.09 19.81,55.25 19.94,55.37 | RPI1.25 37.59,52.49 37.59,55.37 | RPI1.39 56.63,50.18 57.91,48.9 58.42,48.9 59.69,47.62 59.69,45.34 63.12,41.91 v63.5,41.91
  Bottom 0.406: RPI1.34 49.01,55.37 43.94,55.37 | 43.94,55.37 43.94,53.77 RPI1.30 | RPI1.20 31.23,55.37 | 31.23,55.37 37.59,55.37 43.94,55.37 | RPI1.14 23.61,55.37 | 23.61,55.37 31.23,55.37 | RPI1.6 13.45,55.37 19.94,55.37 23.61,55.37
  Bottom 0.813: v63.5,11.43 v63.5,13.97 v63.5,16.51 v63.5,19.05 v63.5,21.59 v63.5,24.13 v63.5,26.67 v63.5,29.21 v63.5,31.75 v63.5,34.29 v63.5,36.83 v63.5,39.37 v63.5,41.91
  Bottom 1.016: v63.5,11.43 63.5,8.64 60.71,8.64
  other vias: 55.63,21.21 13.72,16.38 13.46,22.1 20.57,21.84 20.57,15.88 15.37,7.62 16,12.7 8.89,12.7 23.37,12.7 9.02,6.6 13.21,6.6 36.07,10.29 34.92,15.62 13.34,12.57 17.4,6.22 22.48,6.35 19.94,6.35 21.84,10.29 25.78,14.61 25.65,6.35 29.21,6.98 36.32,12.19 23.88,18.03 23.62,19.81 38.48,18.92 27.3,21.84 29.59,18.41 28.45,14.22 31.37,12.7 34.16,12.7 34.04,5.97 42.93,4.45 43.05,22.22 40.26,12.7 40.26,6.48 40.26,15.75 10.67,3.17 55.12,37.59 48.39,40.13 43.43,42.8 56.39,34.42 54.36,31.37 53.59,29.21 50.16,25.27 8.89,32 11.18,35.43 16.89,35.43 19.56,34.04 11.56,33.91 13.72,33.78 13.72,35.43 17.14,33.78 17.27,38.48 13.59,37.59 11.94,37.72 10.54,40.89 17.27,42.55 11.81,43.18 25.4,43.43 24.13,38.74 22.35,39.75 29.34,38.61 30.35,37.08 26.29,37.21 25.53,33.78 25.4,32 29.08,32 28.45,33.78 32.38,32.26 35.05,34.04 34.42,36.96 33.02,40.77 39.5,39.5 39.62,36.83 39.5,34.29 39.5,31.75 44.2,31.88 44.32,36.2 41.78,28.96 44.32,26.29 27.43,27.43 26.67,38.61 5.33,42.93 4.95,38.1 11.81,39.37 13.84,31.62 12.06,30.99 17.4,31.88 19.68,31.62 20.7,25.91 12.7,29.21 5.84,28.57 28.45,43.31 50.93,11.18 55.12,11.68 56.77,9.02 57.02,12.57 57.15,17.91 48.77,17.78 53.98,6.86 48.77,5.08 50.8,7.11 51.94,22.1 32.26,29.46 21.08,33.78 34.67,27.56 16.26,18.54 17.78,19.94
  pour Top (isolate 0.254): -0.25,0.13 0.08,43.72 62.48,43.84 62.14,0.25
  pour Bottom (isolate 0.254): 0.13,0.13 0.46,43.72 62.86,43.84 62.52,0.25
GPIO4
  Top 0.254: 15.99,50.79 12.7,47.5 CONN1.5
  Top 0.305: 15.99,50.79 RPI1.7
GPIO5
  Bottom 0.305: RPI1.29 43.93,48.78 CONN1.18
GPIO6
  Bottom 0.305: RPI1.31 46.47,48.78 CONN1.19
GPIO12
  Bottom 0.305: RPI1.32 47.75,52.49 47.75,50.17 50.8,47.12 CONN1.20
GPIO13
  Bottom 0.305: RPI1.33 49.1,51.23 49.1,50.09 50.55,48.64 51.18,48.64 52.32,47.5 52.83,47.5 CONN1.21
GPIO16
  Bottom 0.305: RPI1.36 51.55,53.46 50.29,52.2 50.29,50.55 52.2,48.64 54.61,48.64 55.88,47.37 CONN1.22
GPIO17
  Top 0.305: CONN1.6 15.24,48.77 16.26,49.78 20.57,49.78 21.07,50.28 RPI1.11
GPIO18
  Bottom 0.305: CONN1.7 19.81,49.02 19.81,52.07 21.07,53.33 RPI1.12
GPIO19
  Bottom 0.305: RPI1.35 53.12,49.66 55.75,49.66 CONN1.23
GPIO20
  Bottom 0.305: RPI1.38 55.41,52.45 57.4,52.45 58.42,51.44 58.42,49.91 60.96,47.37 CONN1.24
GPIO21
  Bottom 0.305: CONN1.25 61.72,48.77 60.71,48.77 59.31,50.17 59.31,51.82 57.4,53.72 56.68,53.72 RPI1.40
GPIO22
  Top 0.305: CONN1.9 26.15,50.28 RPI1.15
GPIO23
  Bottom 0.305: CONN1.10 24.89,47.5 24.89,52.2 26.15,53.46 RPI1.16
GPIO24
  Top 0.305: CONN1.11 27.43,47.5 27.43,51.82 28.69,53.07 RPI1.18
GPIO25
  Top 0.305: CONN1.12 29.97,47.5 29.97,51.82 30.61,52.45 32.38,52.45 33.7,53.77 RPI1.22
GPIO27
  Top 0.305: CONN1.8 23.61,50.28 RPI1.13
N$1  (via drill 0.39)
  Top 0.203: v7.38,30.14 8.75,30.14 R10.2 | v7.25,28.39 8,27.64 U3.4
  Bottom 0.203: v7.38,30.14 7.38,28.39 v7.25,28.39
N$3
  Top 0.152: 51,23.39 R16.2 | 52.99,23.39 R15.1 53.75,23.59 | 51.12,8.89 Q1.1
  Top 0.203: 56.24,10.11 56.24,24.39 53.75,24.39 53.75,23.59
  Top 0.254: 51.12,8.89 52.34,10.11 56.24,10.11
  Top 0.305: 52.99,23.39 51,23.39
N$16
  Top 0.203: U1.7 51.25,41.77 49.88,41.77 49.66,41.55 49.66,36.83 | R3.1 49.66,36.83 | 49.66,36.83 SJ1.2
N$88
  Top 0.203: U4.4 14.88,27.64 13.62,28.89 13.62,30.14 15.38,30.14 R11.2
N$89  (via drill 0.39)
  Top 0.203: v22.88,31.39 22.88,31.14 22,30.27 R12.2 | v21.25,28.39 22,27.64 U5.4
  Bottom 0.203: v22.88,31.39 22,32.27 21.5,32.27 21,31.77 21,28.39 v21.25,28.39
N$90  (via drill 0.3)
  Top 0.152: 29,27.89 29.5,27.89 U6.4 | 29,27.89 29,30.27 30.38,30.27 R13.2 | 29,27.89 v28.88,27.89
  Top 0.203: 29.52,27.89 29.52,27.64 U6.4
N$91  (via drill 0.3)
  Top 0.152: v41,26.27 41.51,25.76 42.35,25.76 R14.2 | v35.38,26.77 36,27.39 36,27.64 U7.4
  Bottom 0.152: v41,26.27 40.5,26.77 v35.38,26.77
N$133
  Top 0.305: R7.2 50.88,34.3 50.83,34.32 48.7,34.32 LED1.C
OUT1
  Top 0.406: U3.6 9.37,19.21 10.54,18.03 10.54,5.51 X1.2
OUT2
  Top 0.406: U3.8 11.9,4.5 X1.1
OUT3
  Top 0.406: X2.1 18.91,4.48 U4.8
OUT4
  Top 0.406: X2.2 15.95,6.82 17.23,8.1 17.23,11.39 17.27,11.43 17.27,18.8 16.36,19.7 U4.6
OUT5
  Top 0.406: X3.1 26.69,4.19 26.69,15.24 25.91,16.03 U5.8
OUT6
  Top 0.406: U5.6 24,21.26 24,20.65 24.24,20.41 24.64,20.41 24.64,5.64 X3.2
OUT7
  Top 0.152: 33,5.71 33,5.97
  Top 0.406: X4.1 33.42,5.29 33,5.71 | 33,5.97 33,6.22 33.33,6.55 33.33,19.64 33.5,19.81 33.5,21.82 U6.8
OUT8
  Top 0.406: U6.6 30.88,20.97 30.86,20.95 32.77,19.05 32.77,6.78 X4.2
OUT9
  Top 0.152: U7.8 39.88,21.89 39.88,17.52 39.89,17.39
  Top 0.406: 39.89,17.39 41.27,16 41.27,4.8 X5.1
OUT10
  Top 0.406: X5.2 37.35,4.38 37.35,8.07 37.22,8.21 37.22,20.67 37.35,20.8 U7.6
PWM0  (via drill 0.3, 0.39)
  Top 0.152: v6.88,40.77 6.94,40.71 | 8.5,29.02 v8.75,29.02
  Top 0.203: v22.5,33.02 23.62,33.02 24.88,34.27 24.88,35.15 25,35.27 U2.6 | 6.94,40.71 6.62,40.4 6.62,29.39 8.12,29.39 8.5,29.02 8.62,28.89 8.62,28.27 9.25,27.64 U3.3
  Bottom 0.152: v22.5,33.02 22.25,32.77 12.5,32.77 v8.75,29.02
PWM1  (via drill 0.3, 0.39)
  Top 0.203: v25.62,36.52 25.62,35.4 U2.7 | 12.88,30.64 12.81,30.58 | 12.81,30.58 11.38,29.14 11.38,28.27 10.75,27.64 U3.2 | 12.81,30.58 12.81,36.46 v12.75,36.52
  Bottom 0.203: v12.75,36.52 v25.62,36.52
PWM2  (via drill 0.39)
  Top 0.203: v26.75,28.52 26.5,28.77 26.5,35.15 26.38,35.27 U2.8 | v14.38,29.14 16.25,29.14 16.25,27.64 U4.3
  Bottom 0.203: v26.75,28.52 25.88,27.64 15.88,27.64 v14.38,29.14
PWM3  (via drill 0.39)
  Top 0.203: v26.88,36.52 26.88,35.52 27,35.4 U2.9 | v18.5,35.4 18.5,29.02 17.75,28.27 17.75,27.64 U4.2
  Bottom 0.203: v26.88,36.52 26.12,35.77 18.88,35.77 v18.5,35.4
PWM4  (via drill 0.3)
  Top 0.152: v28.25,39.9 28.25,37.02 27.88,36.65 27.88,35.52 27.75,35.4 U2.10 | v24.12,39.65 20.37,35.89 20.37,30.15 21.5,29.02 23.25,29.02 23.25,27.64 U5.3
  Bottom 0.152: v28.25,39.9 28,39.65 v24.12,39.65
PWM5  (via drill 0.3)
  Top 0.152: v27.75,29.77 27.75,34.02 28.12,34.4 28.12,35.15 28.25,35.27 U2.11 | v25.38,29.14 24.75,28.52 24.75,27.64 U5.2
  Bottom 0.152: v27.75,29.77 27.12,29.14 v25.38,29.14
PWM6  (via drill 0.3, 0.39)
  Top 0.152: v30.62,29.39 30.62,27.77 30.75,27.64 U6.3 | v27.12,33.65 v27.12,30.39 | v33.75,34.15 32.38,35.52 v32.12,35.52
  Top 0.203: v29.12,36.52 29.12,35.52 29,35.4 U2.12 | 30.77,27.64 U6.3
  Bottom 0.152: v30.62,29.39 29.62,30.39 v27.12,30.39 | v27.12,33.65 27.88,34.4 33.5,34.4 v33.75,34.15
  Bottom 0.203: v29.12,36.52 30.12,35.52 v32.12,35.52
PWM7  (via drill 0.39)
  Top 0.152: v34.75,29.77 33.38,29.77 33.38,29.27 32.25,28.14 32.25,27.64 U6.2
  Top 0.203: v30.62,33.77 29.75,34.65 29.75,35.15 29.62,35.27 U2.13 | v32.88,33.77 34.75,31.89 v34.75,29.77 | 32.15,27.53 U6.2
  Bottom 0.152: 35.38,29.14 39.25,29.14
  Bottom 0.203: v32.88,33.77 v30.62,33.77 | 35.38,29.14 v34.75,29.77 | v39.5,29.39 39.25,29.14
PWM8  (via drill 0.3)
  Top 0.152: v30.5,42.15 30.5,41.27 30.38,41.15 U2.15 | v35.38,28.52 35.62,28.77 35.62,28.89 35.75,29.02 37.25,29.02 37.25,27.64 U7.3
  Bottom 0.152: v30.5,42.15 39.12,42.15 40.25,41.02 40.25,28.52 v35.38,28.52
PWM9  (via drill 0.3)
  Top 0.152: v30.5,38.65 29.88,39.27 29.88,40.77 29.62,41.02 U2.16 | v33.75,38.52 35.88,36.4 35.88,29.52 36,29.39 38.5,29.39 38.5,27.64 U7.2
  Bottom 0.152: v30.5,38.65 30.62,38.52 v33.75,38.52
PWM12  (via drill 0.3)
  Top 0.152: v27.75,42.27 27.75,41.27 U2.19
  Bottom 0.152: 8.25,42.02 JP1.1
  Bottom 0.203: v27.75,42.27 26,40.52 11.25,40.52 9,38.27 7.37,38.27 6.25,39.39 6.25,42.02 8.25,42.02
PWM13  (via drill 0.39)
  Top 0.203: U2.20 27.01,43.31 26.12,44.2 25.84,44.2 v25.81,44.23 | v22.99,44.45 v15.37,44.45
  Bottom 0.152: 8.38,39.52 JP1.2
  Bottom 0.203: v25.81,44.23 23.21,44.23 v22.99,44.45 | 8.38,39.52 9.88,41.02 9.88,44.4 15.25,44.4 v15.37,44.45
PWM14  (via drill 0.39)
  Top 0.203: v26.37,42.4 v26.37,42.39 26.37,41.15 U2.21 | v12.12,41.15 8.38,37.4 8.38,37.02 JP1.3
  Bottom 0.203: v26.37,42.4 24.86,40.89 12.38,40.89 v12.12,41.15
PWM15  (via drill 0.39)
  Top 0.203: 25.75,41.02 U2.22 25.71,40.13 26.09,39.75 27.56,39.75 27.62,39.69 v27.62,37.27
  Bottom 0.203: v27.62,37.27 27.62,35.27 19.38,35.27 18.62,34.52 8.38,34.52 JP1.4
RXD
  Top 0.305: CONN1.4 12.95,49.78 13.97,49.78 14.73,50.55 14.73,51.82 15.37,52.45 17.14,52.45 18.46,53.77 RPI1.10
SCL  (via drill 0.39)
  Top 0.203: v23.25,43.02 23.25,41.27 23.12,41.15 U2.26
  Top 0.305: CONN1.2 7.11,49.02 11.24,49.02 RPI1.5
  Bottom 0.203: v23.25,43.02 20.5,45.77 14.75,45.77 13.88,46.65 13.88,51.15 13.5,51.15 RPI1.5
SDA  (via drill 0.39)
  Top 0.203: v22.5,42.27 22.5,41.15 U2.27
  Top 0.305: CONN1.1 2.54,47.75 3.56,48.77 4.83,48.77 5.84,49.78 9.91,49.78 10.91,50.79 RPI1.3
  Bottom 0.203: v22.5,42.27 19.5,45.27 7.62,45.27 6.38,46.52 6.38,49.77 9.5,49.77 10.88,51.15 RPI1.3
SPI_CE0
  Top 0.305: CONN1.16 37.59,50.04 37.59,52.2 36.31,53.48 RPI1.24
SPI_CE1
  Bottom 0.305: RPI1.26 38.85,53.61 40.13,52.32 40.13,50.04 CONN1.17
SPI_MISO
  Top 0.305: CONN1.14 33.77,48.78 RPI1.21
SPI_MOSI
  Top 0.305: CONN1.13 31.23,48.78 RPI1.19
SPI_SCLK
  Top 0.305: CONN1.15 36.31,48.78 RPI1.23
TXD
  Bottom 0.305: CONN1.3 10.16,49.53 11.18,49.53 12.19,50.55 12.19,52.32 12.32,52.45 14.61,52.45 15.92,53.77 RPI1.8

### Text on the board
tPlace: SCL | RXD | #17 | #27 | #23 | #25 | MISO | CE0 | #5 | #12 | #16 | #20 | SDA | TXD | #4 | #18 | #22 | #24 | MOSI | CLK | CE1 | #6 | #13 | #19 | #21 | #0 | i2c addr | A4 | #1 | xtra PWM | 14 | A3 | 15 | A2 | A1 | A0 | CinqueValvoleHAT / Tap Controller / 3.6A Max / per channel | Power | jksoftedu.nl | Power | +5V | +3V | GND | 5-12V Motor | + | -
bPlace: jksoftedu.nl | M1 | M2 | M3 | M4 | M5